# EAGLE design esp8266-lights-v3 (EAGLE 9.2.2)

## Sheet 1 of 2
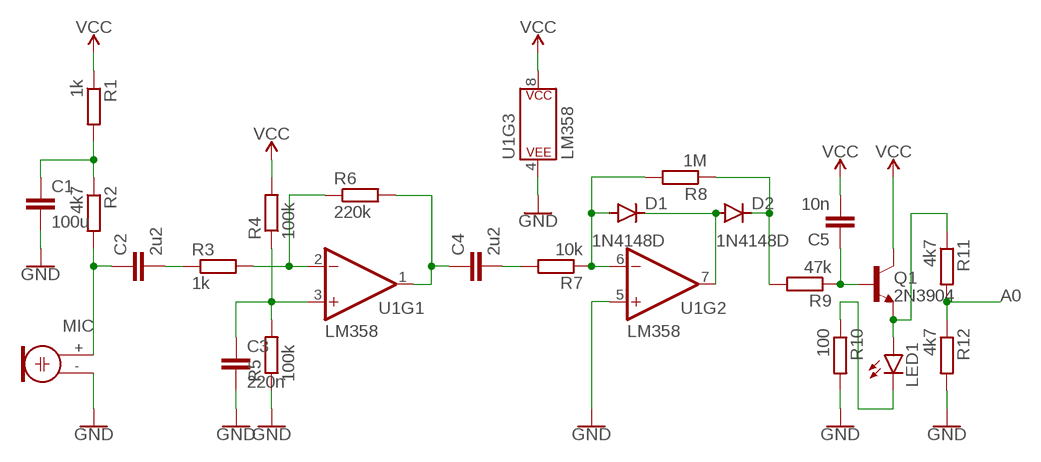
[diagram p0: schematic, sheet 1]

### Parts
C1  100u  C-EU050-024X044  [C050-024X044]
C2  2u2  C-EU050-024X044  [C050-024X044]
C3  220n  C-EU050-024X044  [C050-024X044]
C4  2u2  C-EU050-024X044  [C050-024X044]
C5  10n  C-EU050-024X044  [C050-024X044]
D1  1N4148D  1N4148DO35-10  [DO35-10]
D2  1N4148D  1N4148DO35-10  [DO35-10]
LED1  LED5MM  [LED5MM]
MIC  ELECTRET  [9.7ELECTRET]
Q1  2N3904  [TO92]
R1  1k  R-EU_0309/10  [0309/10]
R2  4k7  R-EU_0309/10  [0309/10]
R3  1k  R-EU_0309/10  [0309/10]
R4  100k  R-EU_0309/10  [0309/10]
R5  100k  R-EU_0309/10  [0309/10]
R6  220k  R-EU_0309/10  [0309/10]
R7  10k  R-EU_0309/10  [0309/10]
R8  1M  R-EU_0309/10  [0309/10]
R9  47k  R-EU_0309/10  [0309/10]
R10  100  R-EU_0309/10  [0309/10]
R11  4k7  R-EU_0309/10  [0309/10]
R12  4k7  R-EU_0309/10  [0309/10]
U1  LM358  LM358KIT  [DIP08-KIT]

### Nets
A0: R11.2 R12.1 ; also sheet 2
GND: C1.2 C3.2 MIC.- R5.1 R10.2 R12.2 U1.4(P$V-) U1.5(+IN) ; also sheet 2
N$3: C2.1 MIC.+ R2.2
N$4: C1.1 R1.2 R2.1
N$5: C2.2 R3.1
N$6: C3.1 R4.1 R5.2 U1.3(+IN)
N$7: R3.2 R6.1 U1.2(-IN)
N$8: C4.1 R6.2 U1.1(OUT)
N$9: C4.2 R7.2
N$10: D1.C D2.A U1.7(OUT)
N$11: D1.A R7.1 R8.2 U1.6(-IN)
N$12: D2.C R8.1 R9.2
N$13: C5.1 Q1.2(B) R9.1
N$14: LED1.K(C) R10.1
N$15: LED1.A Q1.3(E) R11.1
VCC: C5.2 Q1.1(C) R1.1 R4.2 U1.8(P$V+) ; also sheet 2

## Sheet 2 of 2
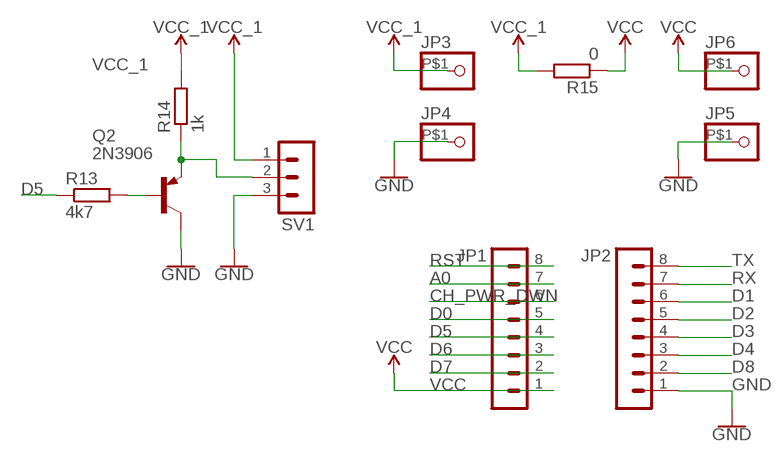
[diagram p1: schematic, sheet 2]

### Parts
JP1  MA08-1  [MA08-1]
JP2  MA08-1  [MA08-1]
JP3  PINHD-1X1-BIGPOGO  [1X1-BIGPOGO]
JP4  PINHD-1X1-BIGPOGO  [1X1-BIGPOGO]
JP5  PINHD-1X1-BIGPOGO  [1X1-BIGPOGO]
JP6  PINHD-1X1-BIGPOGO  [1X1-BIGPOGO]
Q2  2N3906  [TO92]
R13  4k7  R-EU_0309/10  [0309/10]
R14  1k  R-EU_0309/10  [0309/10]
R15  0  R-EU_0309/10  [0309/10]
SV1  MA03-1  [MA03-1]

### Nets
A0: JP1.7 ; also sheet 1
CH_PWR_DWN: JP1.6
D0: JP1.5
D1: JP2.6
D2: JP2.5
D3: JP2.4
D4: JP2.3
D5: JP1.4 R13.1
D6: JP1.3
D7: JP1.2
D8: JP2.2
GND: JP2.1 JP4.P$1 JP5.P$1 Q2.1(C) SV1.3 ; also sheet 1
N$1: Q2.2(B) R13.2
N$2: Q2.3(E) R14.1 SV1.2
RST: JP1.8
RX: JP2.7
TX: JP2.8
VCC: JP1.1 JP6.P$1 R15.1 ; also sheet 1
VCC_1: JP3.P$1 R14.2 R15.2 SV1.1

## Library data of the parts
C1-C5 = rcl:C-EU: CAPACITOR, European symbol; SPICEPREFIX: C
D1 D2 = diode:1N4148: DIODE high speed (Philips)
JP1 JP2 = con-lstb:MA08-1: PIN HEADER; OC_FARNELL: unknown; OC_NEWARK: unknown
JP3-JP6 = adafruit:PINHD-1X1: Pin header 1x1 for 0.1" spacing With round pins
LED1 = led:LED: LED OSRAM: - CHIPLED LG R971, LG N971, LY N971, LG Q971, LY Q971, LO R971, LY R971 LH N974, LH R974 LS Q976, LO Q976, LY Q976 LO Q996 - Hyper CHIPLED LW Q18S LB Q993, LB Q99A, LB R99A - SideLED LS A670, LO A670, LY A670, LG A670, LP A670 LB A673, LV A673, LT A673, LW A673 LH A674 LY A675 LS A676, LA A676, LO A676, LY A676, LW A676 LS A679, LY A679, LG A679 - Hyper Micro SIDELED® LS Y876, LA Y876, LO Y876, LY Y876 LT Y87S - SmartLED LW L88C, LW L88S LB L89C, LB L89S, LG L890 LS L89K, LO L89K, LY L89K LS L896, LA L896, LO L896, LY L896 - TOPLED LS T670, LO T670, LY T670, LG T670, LP T670 LSG T670, LSP T670, LSY T670, LOP T670, LYG T670 LG T671, LOG T671, LSG T671 LB T673, LV T673, LT T673, LW T673 LH T674 LS T676, LA T676, LO T676, LY T676, LB T676, LH T676, LSB T676, LW T676 LB T67C, LV T67C, LT T67C, LS T67K, LO T67K, LY T67K, LW E67C LS E67B, LA E67B, LO E67B, LY E67B, LB E67C, LV E67C, LT E67C LW T67C LS T679, LY T679, LG T679 LS T770, LO T770, LY T770, LG T770, LP T770 LB T773, LV T773, LT T773, LW T773 LH T774 LS E675, LA E675, LY E675, LS T675 LS T776, LA T776, LO T776, LY T776, LB T776 LHGB T686 LT T68C, LB T68C - Hyper Mini TOPLED® LB M676 - Mini TOPLED Santana® LG M470 LS M47K, LO M47K, LY M47K Source: http://www.osram.convergy.de LUXEON: - LUMILED® LXK2-PW12-R00, LXK2-PW12-S00, LXK2-PW14-U00, LXK2-PW14-V00 LXK2-PM12-R00, LXK2-PM12-S00, LXK2-PM14-U00 LXK2-PE12-Q00, LXK2-PE12-R00, LXK2-PE12-S00, LXK2-PE14-T00, LXK2-PE14-U00 LXK2-PB12-K00, LXK2-PB12-L00, LXK2-PB12-M00, LXK2-PB14-N00, LXK2-PB14-P00, LXK2-PB14-Q00 LXK2-PR12-L00, LXK2-PR12-M00, LXK2-PR14-Q00, LXK2-PR14-R00 LXK2-PD12-Q00, LXK2-PD12-R00, LXK2-PD12-S00 LXK2-PH12-R00, LXK2-PH12-S00 LXK2-PL12-P00, LXK2-PL12-Q00, LXK2-PL12-R00 Source: www.luxeon.com KINGBRIGHT: KA-3528ASYC Source: www.kingbright.com
MIC = adafruit:ELECTRET: Electret microphone Thru hole 2.54mm spacing with 9.7mm diameter
Q1 = transistor:2N3904: NPN TRANSISTOR
Q2 = transistor-pnp:2N3906: PNP Transistor
R1-R15 = rcl:R-EU_: RESISTOR, European symbol; SPICEPREFIX: R
SV1 = con-lstb:MA03-1: PIN HEADER; OC_FARNELL: unknown; OC_NEWARK: unknown
U1 = SparkFun-IC-Amplifiers:LM358: LM358 Jellybean op-amp Datasheet <http://www.sparkfun.com/datasheets/Components/General/LM358.pdf> SparkFun Products Op-Amp (Thru-Hole) - LM358 <https://www.sparkfun.com/products/9456> (COM-09456); PROD_ID: IC-09172

## Board
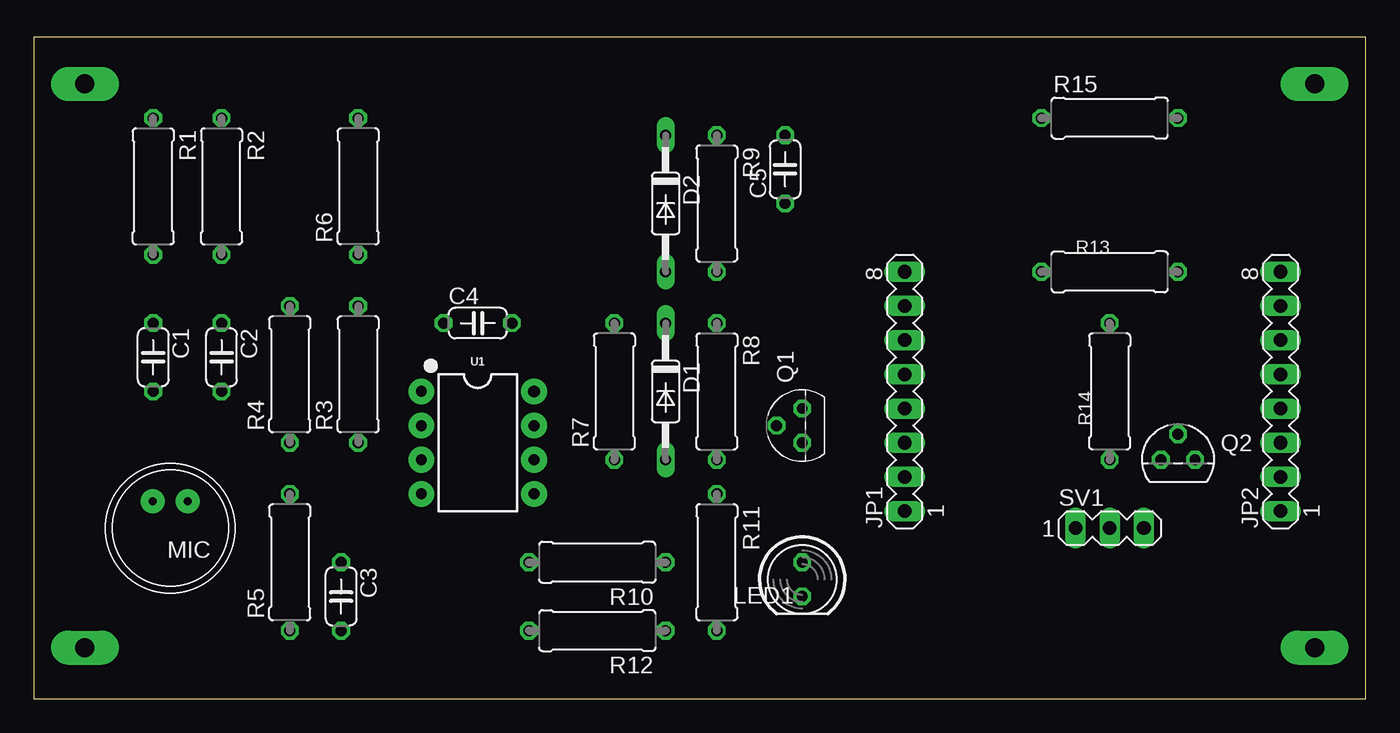
[diagram p2: board, top side]
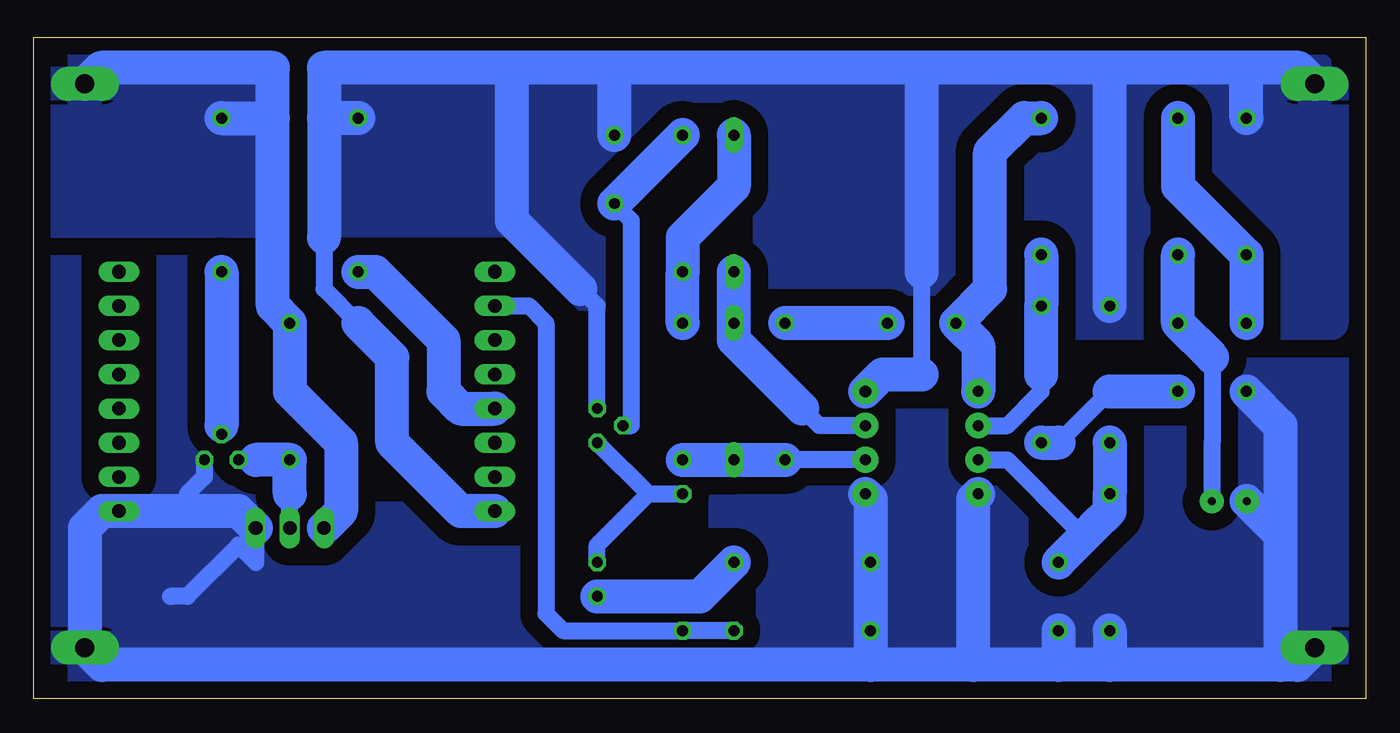
[diagram p3: board, bottom side, seen from below]

Size 99.04 x 49.2 mm. Coordinates in mm from the lower left corner, seen from the top.
Outline: 0,0 99.04,0 99.04,49.2 0,49.2 0,0
Copper layers (1*16): Top 0.035mm / dielectric 1.5mm / Bottom 0.035mm
Design rules "default": minimum track width 6mil, minimum drill 0.35mm, track to track 6mil, track to pad 6mil, pad to pad 6mil, via to via 6mil, smd to smd 6mil, copper to edge 40mil, drill to drill 6mil, minimum pad ring 10mil, minimum via ring 8mil, stop-mask expansion 4mil, vias tented up to drill 0mil, thermal gap 10mil

### Footprints (pad centres in the part's own frame; a part is rotated, then mirrored left to right if it is on the bottom)
C050-024X044 = drill 0.813 octagon: 1 -2.54,0; 2 2.54,0
DO35-10 = drill 0.813 long: A 5.08,0; C -5.08,0
MA08-1 = drill 1.016 long: 1 -8.89,0; 2 -6.35,0; 3 -3.81,0; 4 -1.27,0; 5 1.27,0; 6 3.81,0; 7 6.35,0; 8 8.89,0
1X1-BIGPOGO = drill 1.4 pad 2.54 long: P$1 0,0
LED5MM = drill 0.813 octagon: A -1.27,0; K 1.27,0
9.7ELECTRET = drill 0.6 pad 1.778: + 1.3,2; - -1.3,2
TO92 = drill 0.813 octagon: 1 1.27,0; 2 0,1.905; 3 -1.27,0
0309/10 = drill 0.813 octagon: 1 -5.08,0; 2 5.08,0
MA03-1 = drill 1.016 long: 1 -2.54,0; 2 0,0; 3 2.54,0
DIP08-KIT = drill 0.813 pad 1.905: 1 -3.81,-4.191; 2 -1.27,-4.191; 3 1.27,-4.191; 4 3.81,-4.191; 5 3.81,4.191; 6 1.27,4.191; 7 -1.27,4.191 | drill 0.864 pad 1.905: 8 -3.81,4.191

### Placement (x,y rotation side)
C1  8.89,25.4 270 top
C2  13.97,25.4 270 top
C3  22.86,7.62 270 top
C4  33.02,27.94 0 top
C5  55.88,39.37 90 top
D1  46.99,22.86 270 top
D2  46.99,36.83 270 top
JP1  64.77,22.86 90 top
JP2  92.71,22.86 90 top
JP3  95.25,45.72 0 top
JP4  95.25,3.81 0 top
JP5  3.81,3.81 0 top
JP6  3.81,45.72 0 top
LED1  57.15,8.89 270 top
MIC  10.16,12.7 0 top
Q1  57.15,20.32 90 top
Q2  85.09,17.78 0 top
R1  8.89,38.1 270 top
R2  13.97,38.1 270 top
R3  24.13,24.13 90 top
R4  19.05,24.13 90 top
R5  19.05,10.16 90 top
R6  24.13,38.1 90 top
R7  43.18,22.86 90 top
R8  50.8,22.86 270 top
R9  50.8,36.83 270 top
R10  41.91,10.16 180 top
R11  50.8,10.16 270 top
R12  41.91,5.08 180 top
R13  80.01,31.75 0 top
R14  80.01,22.86 90 top
R15  80.01,43.18 0 top
SV1  80.01,12.7 0 top
U1  33.02,19.05 270 top

### Tracks (layer width: path | path; a pad name or v marks a point on that pad's centre or on a via)
A0
  Bottom 1.27: R12.1 R11.2 59.69,5.08 60.96,6.35 60.96,27.94 62.23,29.21 JP1.7
D5
  Bottom 2.54: R13.1 73.66,31.75 68.58,26.67 68.58,22.86 67.31,21.59 JP1.4
GND
  Bottom 1.27: 8.89,14.73 MIC.- | Q2.1 86.36,16.51 87.63,15.24 87.63,13.97 | SV1.3 82.55,10.16 83.82,11.43 87.63,7.62 88.9,7.62
  Bottom 2.54: JP5.P$1 5.08,2.54 6.35,2.54 | 6.35,2.54 19.05,2.54 | 19.05,2.54 22.86,2.54 | 22.86,2.54 29.21,2.54 | 29.21,2.54 36.83,2.54 | 36.83,2.54 93.98,2.54 JP4.P$1 95.25,12.7 93.98,13.97 JP2.1 87.63,13.97 83.82,13.97 SV1.3 | MIC.- 6.35,12.19 | 6.35,12.19 6.35,2.54 | C3.2 22.86,2.54 | 36.83,2.54 R12.2 R10.2 36.83,14.86 U1.5 | C1.2 6.35,20.32 6.35,12.19 | R5.1 19.05,2.54 | U1.4 29.21,14.86 29.21,2.54
  pour Bottom (isolate 1.27): 1.27,24.13 1.27,1.27 97.79,1.27 97.79,31.75 66.04,31.75 58.42,24.13
N$1
  Bottom 1.27: 85.09,20.32 Q2.2
  Bottom 2.54: R13.2 85.09,20.32
N$2
  Bottom 1.27: 82.55,17.78 Q2.3 | SV1.2 80.01,15.24
  Bottom 2.54: 82.55,17.78 R14.1 80.01,15.24
N$3
  Bottom 1.27: 11.43,25.4 11.43,19.05 11.43,14.73 MIC.+
  Bottom 2.54: R2.2 C2.1 11.43,25.4
N$4
  Bottom 2.54: R2.1 13.97,38.1 R1.2 C1.1
N$5
  Bottom 1.27: 22.86,19.05 19.05,22.86
  Bottom 2.54: R3.1 22.86,19.05 | 19.05,22.86 C2.2
N$6
  Bottom 1.27: U1.3 26.67,17.78 21.59,12.7 20.32,12.7
  Bottom 2.54: R4.1 R5.2 19.05,13.97 20.32,12.7 C3.1
N$7
  Bottom 1.27: U1.2 26.67,20.32 24.13,22.86 24.13,24.13
  Bottom 2.54: R6.1 R3.2 24.13,24.13
N$8
  Bottom 2.54: U1.1 28.83,26.29 C4.1 27.94,30.48 27.94,40.64 25.4,43.18 R6.2
N$9
  Bottom 2.54: C4.2 R7.2
N$10
  Bottom 1.27: 41.91,21.59 40.64,20.32 U1.7
  Bottom 2.54: D2.A D1.C 46.99,26.67 41.91,21.59
N$11
  Bottom 1.27: U1.6 R7.1
  Bottom 2.54: R8.2 D1.A R7.1
N$12
  Bottom 2.54: R8.1 R9.2 50.8,34.29 46.99,38.1 D2.C
N$13
  Bottom 1.27: Q1.2 54.61,20.32 54.61,35.56 C5.1
  Bottom 2.54: R9.1 C5.1
N$14
  Bottom 2.54: LED1.K 49.53,7.62 R10.1
N$15
  Bottom 1.27: Q1.3 53.34,15.24 | 53.34,15.24 R11.1 | LED1.A 57.15,11.43 53.34,15.24
VCC
  Bottom 1.27: 33.02,24.13 33.02,31.75 | Q1.1 57.15,29.21 58.42,30.48 | 77.47,34.29 77.47,30.48 74.93,27.94
  Bottom 2.54: JP6.P$1 5,46.91 8.89,46.91 | 8.89,46.91 19.05,46.91 | 19.05,46.91 33.02,46.91 | 33.02,46.91 55.88,46.91 | 55.88,46.91 63.5,46.91 | R1.1 8.89,46.91 | R4.2 19.05,46.91 | C5.2 55.88,46.91 | U1.8 35.94,24.13 33.02,24.13 | 33.02,31.75 33.02,46.91 | 58.42,30.48 63.5,35.56 63.5,46.91 | 63.5,46.91 77.47,46.91 77.47,43.18 | 77.47,43.18 77.47,34.29 | JP1.1 67.31,13.97 72.39,19.05 72.39,25.4 74.93,27.94 | R15.1 77.47,43.18
  pour Bottom (isolate 1.27): 2.54,27.94 55.88,27.94 63.5,35.56 77.47,35.56 77.47,46.99 3.81,46.99 2.54,45.72
VCC_1
  Bottom 2.54: SV1.1 76.2,13.97 76.2,19.05 80.01,22.86 R14.2 81.28,29.21 81.28,43.18 | 81.28,43.18 81.28,46.91 94.06,46.91 JP3.P$1 | R15.2 81.28,43.18
  pour Bottom (isolate 1.27): 81.28,46.99 96.52,46.99 97.79,45.72 97.79,35.56 81.28,35.56